# Altium schematic sheet FPGA_52_External_Memory.SchDoc
size A4; Organization: Altium Limited; Address1: L3, 12a Rodborough Rd; Address2: Frenchs Forest; Address3: NSW; Address4: Australia 2086; DocumentNumber: 1; SheetNumber: 1; SheetTotal: 2
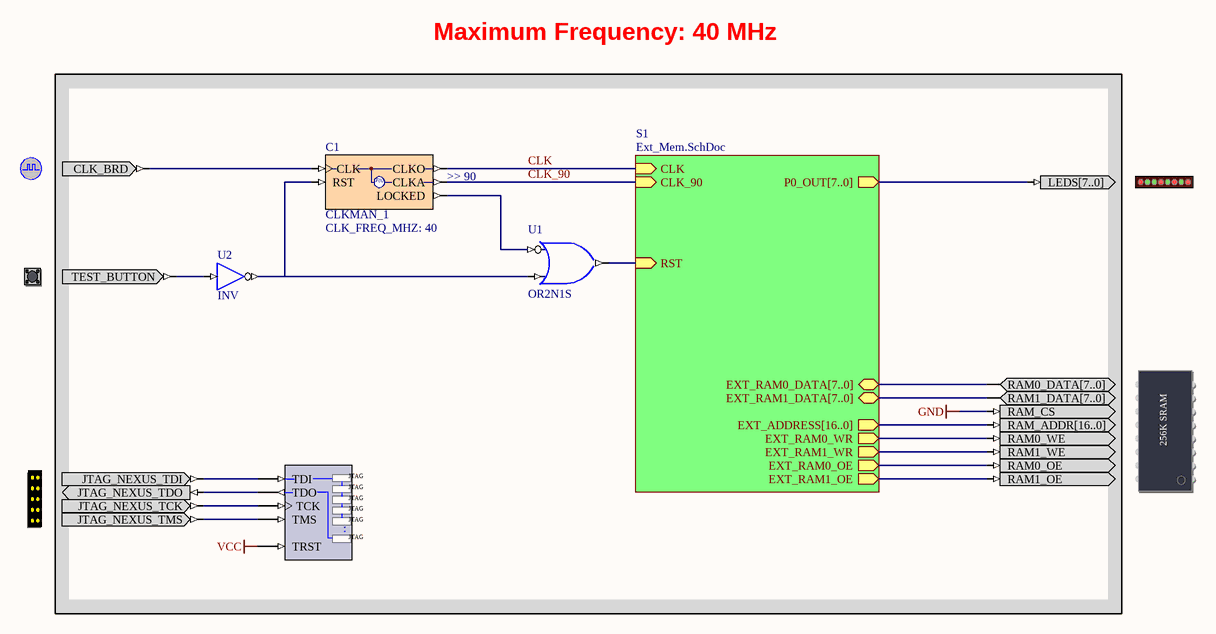
[diagram p0: FPGA_52_External_Memory.SchDoc]

## Parts
(Parts that share a designator on the sheet are numbered #1, #2 ... from top to bottom, then left to right.)
?#1  CLOCK_BOARD  (value not drawn)
?#2  LED  (value not drawn)
?#3  TEST_BUTTON  (value not drawn)
?#4  MEMORY256KX8  (value not drawn)
?#5  NEXUS_JTAG_CONNECTOR  (value not drawn)
C1  CLKMAN_1  CLK_FREQ_MHZ: 40  ClkA_Operation: >> 90
NEXUS_JTAG_PORT  NEXUS_JTAG_PORT  (value not drawn)
U1  OR2N1S
U2  INV

## Sub-sheets
S1 = Ext_Mem.SchDoc: CLK (in), RST (in), P0_OUT[7..0] (out), EXT_ADDRESS[16..0] (out), EXT_RAM1_DATA[7..0] (bidir), EXT_RAM1_WR (out), EXT_RAM1_OE (out), EXT_RAM0_DATA[7..0] (bidir), EXT_RAM0_WR (out), EXT_RAM0_OE (out), CLK_90 (in)

## Nets
GND: ?#4.RAM_CS
VCC: NEXUS_JTAG_PORT.TRST
CLK: C1.CLKO ; sheet S1/CLK
CLK_90: C1.CLKA ; sheet S1/CLK_90
Net?#1_CLK_BRD: ?#1.CLK_BRD C1.CLK
Net?#2_LEDS[7..0]: ?#2.LEDS[7..0] ; sheet S1/P0_OUT[7..0]
Net?#3_TEST_BUTTON: ?#3.TEST_BUTTON U2.I
Net?#4_RAM0_DATA[7..0]: ?#4.RAM0_DATA[7..0] ; sheet S1/EXT_RAM0_DATA[7..0]
Net?#4_RAM0_OE: ?#4.RAM0_OE ; sheet S1/EXT_RAM0_OE
Net?#4_RAM0_WE: ?#4.RAM0_WE ; sheet S1/EXT_RAM0_WR
Net?#4_RAM1_DATA[7..0]: ?#4.RAM1_DATA[7..0] ; sheet S1/EXT_RAM1_DATA[7..0]
Net?#4_RAM1_OE: ?#4.RAM1_OE ; sheet S1/EXT_RAM1_OE
Net?#4_RAM1_WE: ?#4.RAM1_WE ; sheet S1/EXT_RAM1_WR
Net?#4_RAM_ADDR[16..0]: ?#4.RAM_ADDR[16..0] ; sheet S1/EXT_ADDRESS[16..0]
Net?#5_JTAG_NEXUS_TCK: ?#5.JTAG_NEXUS_TCK NEXUS_JTAG_PORT.TCK
Net?#5_JTAG_NEXUS_TDI: ?#5.JTAG_NEXUS_TDI NEXUS_JTAG_PORT.TDI
Net?#5_JTAG_NEXUS_TDO: ?#5.JTAG_NEXUS_TDO NEXUS_JTAG_PORT.TDO
Net?#5_JTAG_NEXUS_TMS: ?#5.JTAG_NEXUS_TMS NEXUS_JTAG_PORT.TMS
NetC1_LOCKED: C1.LOCKED U1.I0
NetC1_RST: C1.RST U1.I1 U2.O
NetU1_O: U1.O ; sheet S1/RST

## Notes on the sheet
- Maximum Frequency: 40 MHz
- Title
- Size:
- Date:
- A4
- Number:
- Time:
- Revision:
- Sheet
- of
- File:
- (in symbol CLKMAN_1) F(x)
- (in symbol MEMORY256KX8) 256K SRAM
- (in symbol NEXUS_JTAG_PORT) JTAG; .

## Library data of the parts
?#1 = CLOCK_BOARD: Global System Clock Supply; PortComponent: True; Published: 19-Nov-2003; Publisher: Altium Limited
?#2 = LED: 8-Way LEDS; PortComponent: True; Published: 19-Nov-2003; Publisher: Altium Limited
?#3 = TEST_BUTTON: Test Button; PortComponent: True; Published: 19-Nov-2003; Publisher: Altium Limited
?#4 = MEMORY256KX8: SRAM 256kx8; PortComponent: True; Published: 19-Nov-2003; Publisher: Altium Limited
?#5 = NEXUS_JTAG_CONNECTOR: JTAG Port; PortComponent: True; Published: 19-Nov-2003; Publisher: Altium Limited
C1 = CLKMAN_1: Single Operational Output Clock Manager; Clk_Count: 1; Published: 5-Jul-2004; Publisher: Altium Limited; Core Revision: 1.00.00; Nexus_Core: ClockManager; HelpURL: CR0118 FPGA Generic Library Guide.pdf#page=148; Functional Class: Clock Manager; Port Size: 1
NEXUS_JTAG_PORT = NEXUS_JTAG_PORT: Soft Nexus-Chain Connector; NEXUS_JTAG_CONNECTOR: True; Published: 18-Dec-2003; Publisher: Altium Limited
U1 = OR2N1S: 2-Input OR Gate with Active Low A Input, Single Pin Version; Xilinx Equivalent: OR2B1; ArchiveName: GENERIC; VHDLIB_SIM: GENERIC_LIB; Published: 29-Jan-2004; Publisher: Altium Limited; Core Revision: 1.00.00
U2 = INV: Inverter; ArchiveName: GENERIC; VHDLIB_SIM: GENERIC_LIB; Published: 29-Jan-2004; Publisher: Altium Limited; Xilinx Equivalent: INV; Core Revision: 1.00.00